# EAGLE design BMSMAX14921Based (EAGLE 8.3.1)
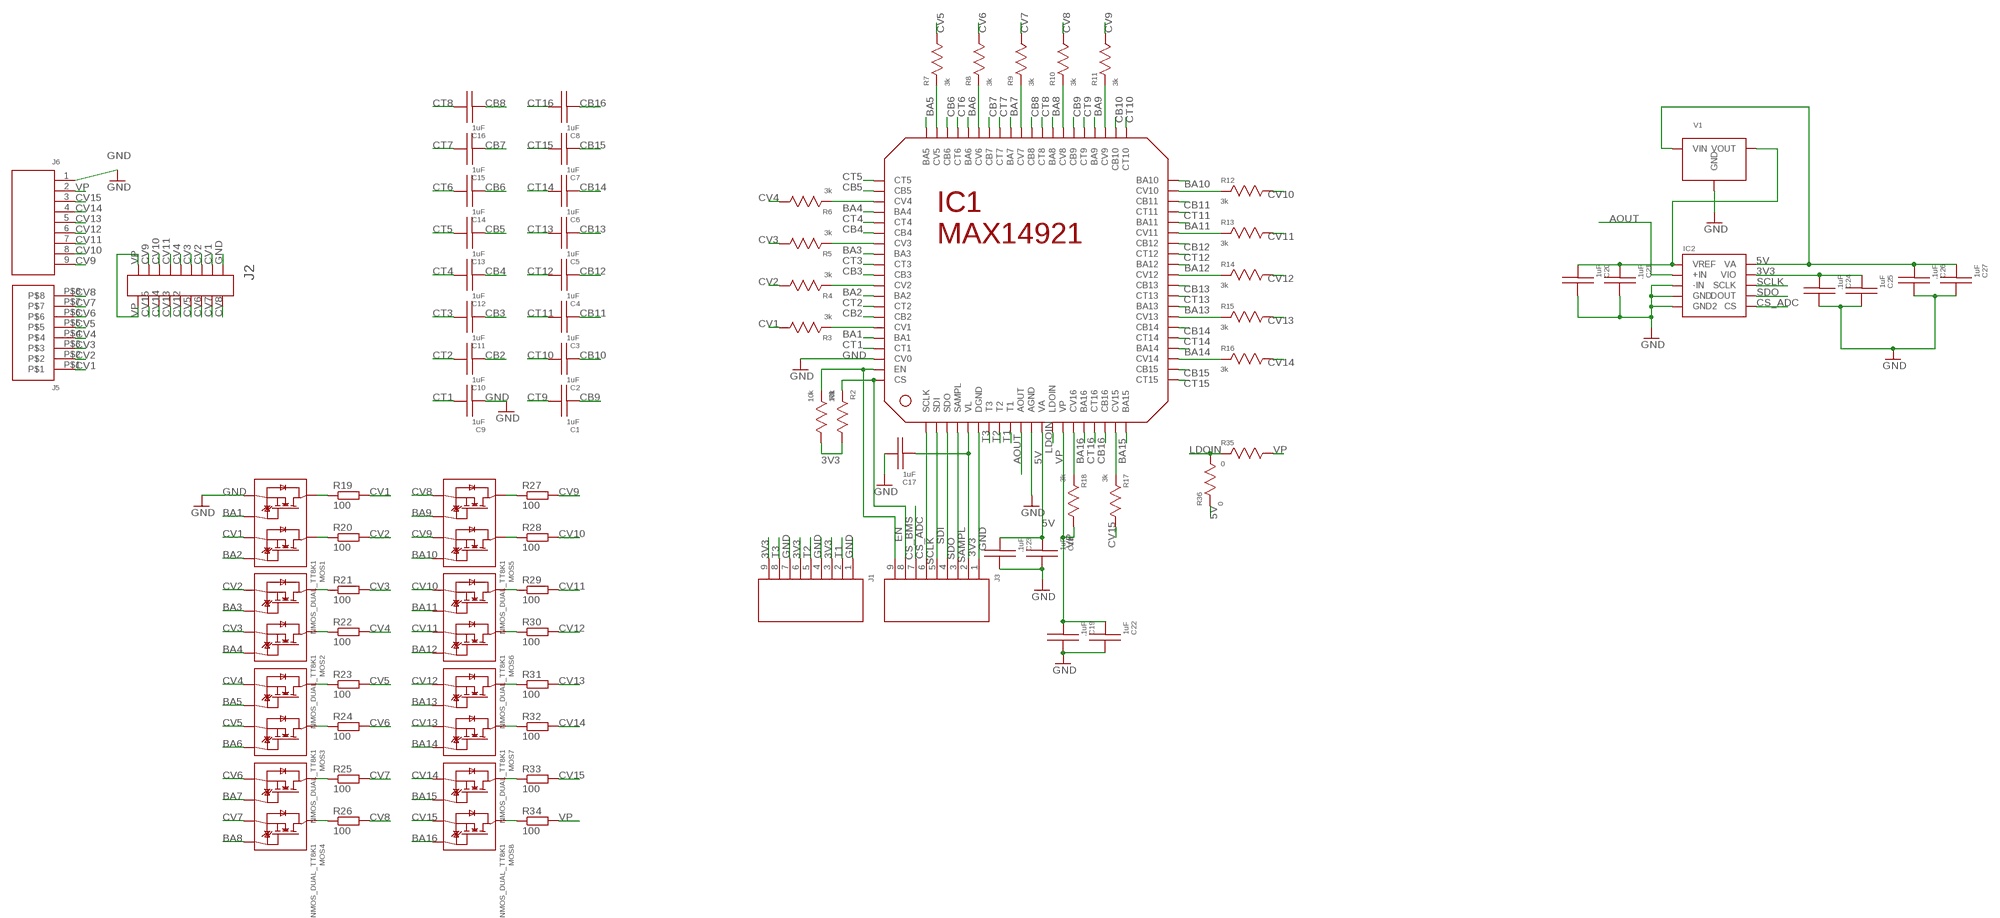
[diagram p0: schematic, sheet 1]

## Parts
C1  1uF  CHIP_CAP0805  [0805_(2012_METRIC)]
C2  1uF  CHIP_CAP0805  [0805_(2012_METRIC)]
C3  1uF  CHIP_CAP0805  [0805_(2012_METRIC)]
C4  1uF  CHIP_CAP0805  [0805_(2012_METRIC)]
C5  1uF  CHIP_CAP0805  [0805_(2012_METRIC)]
C6  1uF  CHIP_CAP0805  [0805_(2012_METRIC)]
C7  1uF  CHIP_CAP0805  [0805_(2012_METRIC)]
C8  1uF  CHIP_CAP0805  [0805_(2012_METRIC)]
C9  1uF  CHIP_CAP0805  [0805_(2012_METRIC)]
C10  1uF  CHIP_CAP0805  [0805_(2012_METRIC)]
C11  1uF  CHIP_CAP0805  [0805_(2012_METRIC)]
C12  1uF  CHIP_CAP0805  [0805_(2012_METRIC)]
C13  1uF  CHIP_CAP0805  [0805_(2012_METRIC)]
C14  1uF  CHIP_CAP0805  [0805_(2012_METRIC)]
C15  1uF  CHIP_CAP0805  [0805_(2012_METRIC)]
C16  1uF  CHIP_CAP0805  [0805_(2012_METRIC)]
C17  1uF  CHIP_CAP0805  [0805_(2012_METRIC)]
C18  1uF  CHIP_CAP0805  [0805_(2012_METRIC)]
C19  .1uF  CHIP_CAP0805  [0805_(2012_METRIC)]
C20  1uF  CHIP_CAP0805  [0805_(2012_METRIC)]
C21  .1uF  CHIP_CAP0805  [0805_(2012_METRIC)]
C22  1uF  CHIP_CAP0805  [0805_(2012_METRIC)]
C23  .1uF  CHIP_CAP0805  [0805_(2012_METRIC)]
C24  .1uF  CHIP_CAP0805  [0805_(2012_METRIC)]
C25  1uF  CHIP_CAP0805  [0805_(2012_METRIC)]
C26  .1uF  CHIP_CAP0805  [0805_(2012_METRIC)]
C27  1uF  CHIP_CAP0805  [0805_(2012_METRIC)]
IC1  MAX14921  [80TQFP]
IC2  ADC141S626  [10-VSSOP]
J1  CONNECTOR_9PIN  [9PIN_.1']
J2  CONNECTORJST2X9_2MM  [CONNECTOR9X2_2MMPITCH]
J3  CONNECTOR_9PIN  [9PIN_.1']
J5  CONNECTOR_8PIN  [8PIN_.1']
J6  CONNECTOR_9PIN  [9PIN_.1']
MOS1  NMOS_DUAL_TT8K1  [TSST8]
MOS2  NMOS_DUAL_TT8K1  [TSST8]
MOS3  NMOS_DUAL_TT8K1  [TSST8]
MOS4  NMOS_DUAL_TT8K1  [TSST8]
MOS5  NMOS_DUAL_TT8K1  [TSST8]
MOS6  NMOS_DUAL_TT8K1  [TSST8]
MOS7  NMOS_DUAL_TT8K1  [TSST8]
MOS8  NMOS_DUAL_TT8K1  [TSST8]
R1  10k  CHIP_RES0805  [0805_(2012_METRIC)]
R2  10k  CHIP_RES0805  [0805_(2012_METRIC)]
R3  3k  CHIP_RES0805  [0805_(2012_METRIC)]
R4  3k  CHIP_RES0805  [0805_(2012_METRIC)]
R5  3k  CHIP_RES0805  [0805_(2012_METRIC)]
R6  3k  CHIP_RES0805  [0805_(2012_METRIC)]
R7  3k  CHIP_RES0805  [0805_(2012_METRIC)]
R8  3k  CHIP_RES0805  [0805_(2012_METRIC)]
R9  3k  CHIP_RES0805  [0805_(2012_METRIC)]
R10  3k  CHIP_RES0805  [0805_(2012_METRIC)]
R11  3k  CHIP_RES0805  [0805_(2012_METRIC)]
R12  3k  CHIP_RES0805  [0805_(2012_METRIC)]
R13  3k  CHIP_RES0805  [0805_(2012_METRIC)]
R14  3k  CHIP_RES0805  [0805_(2012_METRIC)]
R15  3k  CHIP_RES0805  [0805_(2012_METRIC)]
R16  3k  CHIP_RES0805  [0805_(2012_METRIC)]
R17  3k  CHIP_RES0805  [0805_(2012_METRIC)]
R18  3k  CHIP_RES0805  [0805_(2012_METRIC)]
R19  100  R-EU_0411/3V  [0411V]
R20  100  R-EU_0411/3V  [0411V]
R21  100  R-EU_0411/3V  [0411V]
R22  100  R-EU_0411/3V  [0411V]
R23  100  R-EU_0411/3V  [0411V]
R24  100  R-EU_0411/3V  [0411V]
R25  100  R-EU_0411/3V  [0411V]
R26  100  R-EU_0411/3V  [0411V]
R27  100  R-EU_0411/3V  [0411V]
R28  100  R-EU_0411/3V  [0411V]
R29  100  R-EU_0411/3V  [0411V]
R30  100  R-EU_0411/3V  [0411V]
R31  100  R-EU_0411/3V  [0411V]
R32  100  R-EU_0411/3V  [0411V]
R33  100  R-EU_0411/3V  [0411V]
R34  100  R-EU_0411/3V  [0411V]
R35  0  CHIP_RES0805  [0805_(2012_METRIC)]
R36  0  CHIP_RES0805  [0805_(2012_METRIC)]
V1  REF3040  [SOT-23]

## Nets
3V3: C17.P$2 C24.P$2 C25.P$2 IC1.P$5(VL) IC2.P$9(VIO) J1.3 J1.6 J1.9 J3.2 R1.P$1 R2.P$1
5V: C18.P$2 C23.P$2 C26.P$2 C27.P$2 IC1.P$12(VA) IC2.P$10(VA) R36.P$2 V1.1(VIN)
AOUT: IC1.P$10(AOUT) IC2.P$2(+IN)
BA1: IC1.P$76(BA1) MOS1.P$2(G1)
BA2: IC1.P$72(BA2) MOS1.P$4(G2)
BA3: IC1.P$68(BA3) MOS2.P$2(G1)
BA4: IC1.P$64(BA4) MOS2.P$4(G2)
BA5: IC1.P$60(BA5) MOS3.P$2(G1)
BA6: IC1.P$56(BA6) MOS3.P$4(G2)
BA7: IC1.P$52(BA7) MOS4.P$2(G1)
BA8: IC1.P$48(BA8) MOS4.P$4(G2)
BA9: IC1.P$44(BA9) MOS5.P$2(G1)
BA10: IC1.P$40(BA10) MOS5.P$4(G2)
BA11: IC1.P$36(BA11) MOS6.P$2(G1)
BA12: IC1.P$32(BA12) MOS6.P$4(G2)
BA13: IC1.P$28(BA13) MOS7.P$2(G1)
BA14: IC1.P$24(BA14) MOS7.P$4(G2)
BA15: IC1.P$20(BA15) MOS8.P$2(G1)
BA16: IC1.P$16(BA16) MOS8.P$4(G2)
CB2: C10.P$2 IC1.P$74(CB2)
CB3: C11.P$2 IC1.P$70(CB3)
CB4: C12.P$2 IC1.P$66(CB4)
CB5: C13.P$2 IC1.P$62(CB5)
CB6: C14.P$2 IC1.P$58(CB6)
CB7: C15.P$2 IC1.P$54(CB7)
CB8: C16.P$2 IC1.P$50(CB8)
CB9: C1.P$2 IC1.P$46(CB9)
CB10: C2.P$2 IC1.P$42(CB10)
CB11: C3.P$2 IC1.P$38(CB11)
CB12: C4.P$2 IC1.P$34(CB12)
CB13: C5.P$2 IC1.P$30(CB13)
CB14: C6.P$2 IC1.P$26(CB14)
CB15: C7.P$2 IC1.P$22(CB15)
CB16: C8.P$2 IC1.P$18(CB16)
CS_ADC: IC2.P$6(CS) J3.7
CS_BMS: IC1.P$80(CS) J3.8 R2.P$2
CT1: C9.P$1 IC1.P$77(CT1)
CT2: C10.P$1 IC1.P$73(CT2)
CT3: C11.P$1 IC1.P$69(CT3)
CT4: C12.P$1 IC1.P$65(CT4)
CT5: C13.P$1 IC1.P$61(CT5)
CT6: C14.P$1 IC1.P$57(CT6)
CT7: C15.P$1 IC1.P$53(CT7)
CT8: C16.P$1 IC1.P$49(CT8)
CT9: C1.P$1 IC1.P$45(CT9)
CT10: C2.P$1 IC1.P$41(CT10)
CT11: C3.P$1 IC1.P$37(CT11)
CT12: C4.P$1 IC1.P$33(CT12)
CT13: C5.P$1 IC1.P$29(CT13)
CT14: C6.P$1 IC1.P$25(CT14)
CT15: C7.P$1 IC1.P$21(CT15)
CT16: C8.P$1 IC1.P$17(CT16)
CV1: J2.P$2 J5.P$1 MOS1.P$3(S2) R3.P$1 R19.2
CV2: J2.P$3 J5.P$2 MOS2.P$1(S1) R4.P$1 R20.2
CV3: J2.P$4 J5.P$3 MOS2.P$3(S2) R5.P$1 R21.2
CV4: J2.P$5 J5.P$4 MOS3.P$1(S1) R6.P$1 R22.2
CV5: J2.P$15 J5.P$5 MOS3.P$3(S2) R7.P$1 R23.2
CV6: J2.P$16 J5.P$6 MOS4.P$1(S1) R8.P$1 R24.2
CV7: J2.P$17 J5.P$7 MOS4.P$3(S2) R9.P$1 R25.2
CV8: J2.P$18 J5.P$8 MOS5.P$1(S1) R10.P$1 R26.2
CV9: J2.P$8 J6.9 MOS5.P$3(S2) R11.P$1 R27.2
CV10: J2.P$7 J6.8 MOS6.P$1(S1) R12.P$1 R28.2
CV11: J2.P$6 J6.7 MOS6.P$3(S2) R13.P$1 R29.2
CV12: J2.P$14 J6.6 MOS7.P$1(S1) R14.P$1 R30.2
CV13: J2.P$13 J6.5 MOS7.P$3(S2) R15.P$1 R31.2
CV14: J2.P$12 J6.4 MOS8.P$1(S1) R16.P$1 R32.2
CV15: J2.P$11 J6.3 MOS8.P$3(S2) R17.P$1 R33.2
EN: IC1.P$79(EN) J3.9 R1.P$2
GND: C9.P$2 C17.P$1 C18.P$1 C19.P$1 C20.P$1 C21.P$1 C22.P$1 C23.P$1 C24.P$1 C25.P$1 C26.P$1 C27.P$1 IC1.P$6(DGND) IC1.P$11(AGND) IC1.P$78(CV0) IC2.P$3(-IN) IC2.P$4(GND) IC2.P$5(GND2) J1.1 J1.4 J1.7 J2.P$1 J3.1 J6.1 MOS1.P$1(S1) V1.3(GND)
LDOIN: IC1.P$13(LDOIN) R35.P$2 R36.P$1
N$2: MOS1.P$7(D1) MOS1.P$8(D1) R19.1
N$8: C20.P$2 C21.P$2 IC2.P$1(VREF) V1.2(VOUT)
N$9: IC1.P$71(CV2) R4.P$2
N$11: IC1.P$67(CV3) R5.P$2
N$12: IC1.P$75(CV1) R3.P$2
N$26: IC1.P$63(CV4) R6.P$2
N$29: IC1.P$59(CV5) R7.P$2
N$30: IC1.P$55(CV6) R8.P$2
N$31: IC1.P$51(CV7) R9.P$2
N$32: IC1.P$47(CV8) R10.P$2
N$33: IC1.P$43(CV9) R11.P$2
N$34: IC1.P$39(CV10) R12.P$2
N$35: IC1.P$35(CV11) R13.P$2
N$36: IC1.P$31(CV12) R14.P$2
N$37: IC1.P$27(CV13) R15.P$2
N$38: IC1.P$23(CV14) R16.P$2
N$39: IC1.P$19(CV15) R17.P$2
N$40: IC1.P$15(CV16) R18.P$2
N$41: MOS1.P$5(D2) MOS1.P$6(D2) R20.1
N$42: MOS2.P$7(D1) MOS2.P$8(D1) R21.1
N$43: MOS2.P$5(D2) MOS2.P$6(D2) R22.1
N$44: MOS3.P$7(D1) MOS3.P$8(D1) R23.1
N$45: MOS3.P$5(D2) MOS3.P$6(D2) R24.1
N$46: MOS4.P$7(D1) MOS4.P$8(D1) R25.1
N$47: MOS4.P$5(D2) MOS4.P$6(D2) R26.1
N$48: MOS5.P$7(D1) MOS5.P$8(D1) R27.1
N$49: MOS5.P$5(D2) MOS5.P$6(D2) R28.1
N$50: MOS6.P$7(D1) MOS6.P$8(D1) R29.1
N$51: MOS6.P$5(D2) MOS6.P$6(D2) R30.1
N$52: MOS7.P$7(D1) MOS7.P$8(D1) R31.1
N$53: MOS7.P$5(D2) MOS7.P$6(D2) R32.1
N$54: MOS8.P$7(D1) MOS8.P$8(D1) R33.1
N$55: MOS8.P$5(D2) MOS8.P$6(D2) R34.1
SAMPL: IC1.P$4(SAMPL) J3.3
SCLK: IC1.P$1(SCLK) IC2.P$8(SCLK) J3.6
SDI: IC1.P$2(SDI) J3.5
SDO: IC1.P$3(SDO) IC2.P$7(DOUT) J3.4
T1: IC1.P$9(T1) J1.2
T2: IC1.P$8(T2) J1.5
T3: IC1.P$7(T3) J1.8
VP: C19.P$2 C22.P$2 IC1.P$14(VP) J2.P$9 J2.P$10 J6.2 R18.P$1 R34.2 R35.P$1

## Library data of the parts
C1-C27 = lolomolo:CHIP_CAP
IC1 = MarkIIEaglelbr:MAX14921
IC2 = MarkIIEaglelbr:ADC141S626
J1 J3 J6 = lolomolo:CONNECTOR_9PIN
J2 = MarkIIEaglelbr:CONNECTORJST2X9_2MM
J5 = lolomolo:CONNECTOR_8PIN
MOS1-MOS8 = MarkIIEaglelbr:NMOS_DUAL_TT8K1
R1-R18 R35 R36 = lolomolo:CHIP_RES
R19-R34 = rcl:R-EU_: RESISTOR, European symbol
V1 = MarkIIEaglelbr:REF3040

## Board
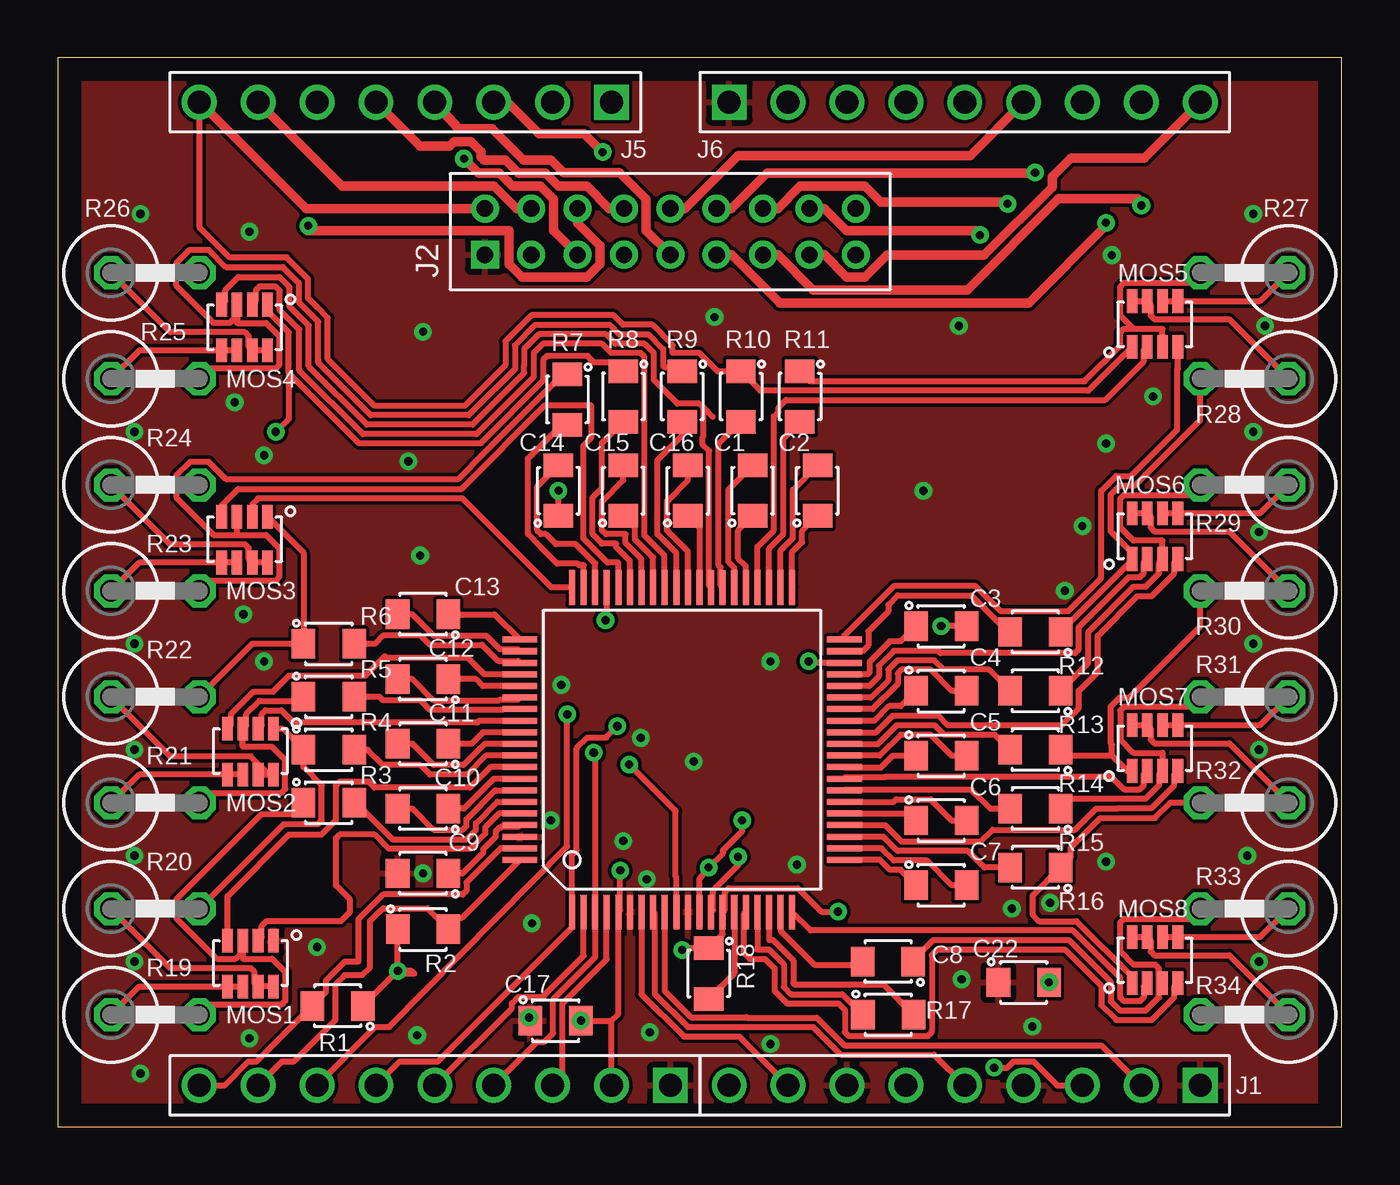
[diagram p1: board, top side]
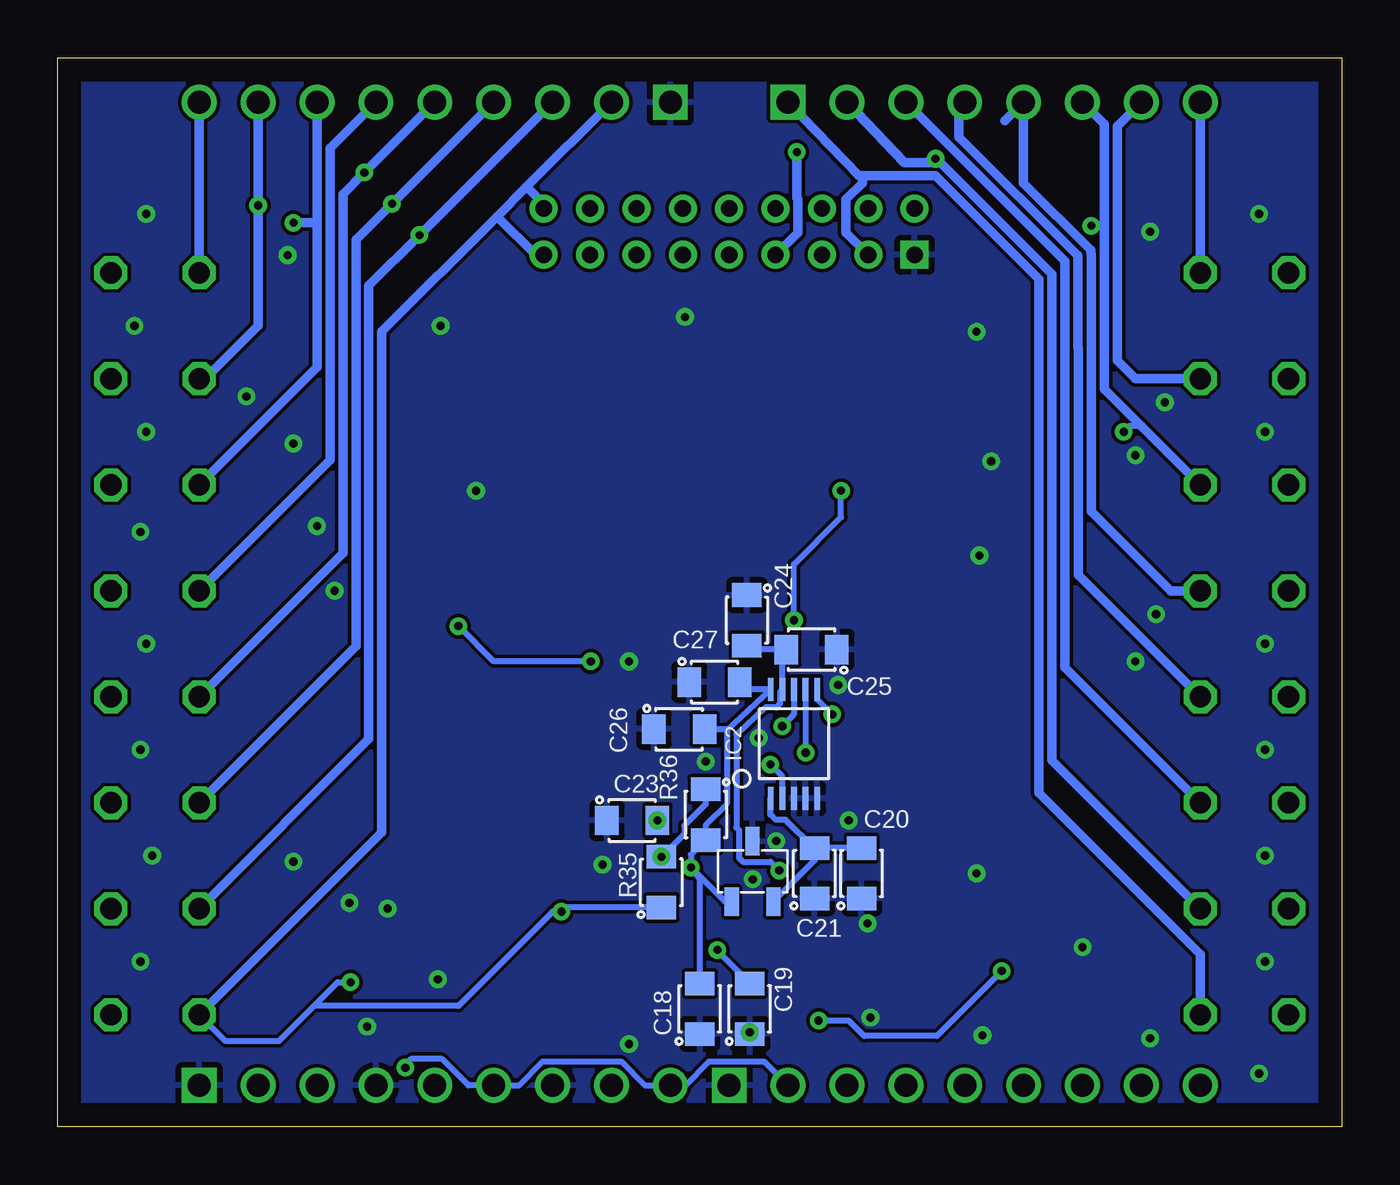
[diagram p2: board, bottom side, seen from below]

Size 55.37 x 46.1 mm. Coordinates in mm from the lower left corner, seen from the top.
Outline: 0,0 55.37,0 55.37,46.1 0,46.1 0,0
Copper layers (1*16): Top 0.035mm / dielectric 1.5mm / Bottom 0.035mm
Design rules "default": minimum track width 6mil, minimum drill 0.35mm, track to track 6mil, track to pad 6mil, pad to pad 6mil, via to via 6mil, smd to smd 6mil, copper to edge 40mil, drill to drill 6mil, minimum pad ring 10mil, minimum via ring 8mil, stop-mask expansion 4mil, vias tented up to drill 0mil, thermal gap 10mil

### Footprints (pad centres in the part's own frame; a part is rotated, then mirrored left to right if it is on the bottom)
0805_(2012_METRIC) = smd 1.016 x 1.27: P$1 -1.087,0; P$2 1.097,0
80TQFP = smd 0.26 x 1.5: P$1 -4.75,-7; P$2 -4.25,-7; P$3 -3.75,-7; P$4 -3.25,-7; P$5 -2.75,-7; P$6 -2.25,-7; P$7 -1.75,-7; P$8 -1.25,-7; P$9 -0.75,-7; P$10 -0.25,-7; P$11 0.25,-7; P$12 0.75,-7; P$13 1.25,-7; P$14 1.75,-7; P$15 2.25,-7; P$16 2.75,-7; P$17 3.25,-7; P$18 3.75,-7; P$19 4.25,-7; P$20 4.75,-7; P$41 4.75,7; P$42 4.25,7; P$43 3.75,7; P$44 3.25,7; P$45 2.75,7; P$46 2.25,7; P$47 1.75,7; P$48 1.25,7; P$49 0.75,7; P$50 0.25,7; P$51 -0.25,7; P$52 -0.75,7; P$53 -1.25,7; P$54 -1.75,7; P$55 -2.25,7; P$56 -2.75,7; P$57 -3.25,7; P$58 -3.75,7; P$59 -4.25,7; P$60 -4.75,7 | smd 1.5 x 0.26: P$21 7,-4.75; P$22 7,-4.25; P$23 7,-3.75; P$24 7,-3.25; P$25 7,-2.75; P$26 7,-2.25; P$27 7,-1.75; P$28 7,-1.25; P$29 7,-0.75; P$30 7,-0.25; P$31 7,0.25; P$32 7,0.75; P$33 7,1.25; P$34 7,1.75; P$35 7,2.25; P$36 7,2.75; P$37 7,3.25; P$38 7,3.75; P$39 7,4.25; P$40 7,4.75; P$61 -7,4.75; P$62 -7,4.25; P$63 -7,3.75; P$64 -7,3.25; P$65 -7,2.75; P$66 -7,2.25; P$67 -7,1.75; P$68 -7,1.25; P$69 -7,0.75; P$70 -7,0.25; P$71 -7,-0.25; P$72 -7,-0.75; P$73 -7,-1.25; P$74 -7,-1.75; P$75 -7,-2.25; P$76 -7,-2.75; P$77 -7,-3.25; P$78 -7,-3.75; P$79 -7,-4.25; P$80 -7,-4.75
10-VSSOP = smd 0.25 x 1: P$1 -1,-2.35; P$2 -0.5,-2.35; P$3 0,-2.35; P$4 0.5,-2.35; P$5 1,-2.35; P$6 1,2.35; P$7 0.5,2.35; P$8 0,2.35; P$9 -0.5,2.35; P$10 -1,2.35
9PIN_.1' = drill 0.991 square: 1 -10.16,0 | drill 0.991: 2 -7.62,0; 3 -5.08,0; 4 -2.54,0; 5 0,0; 6 2.54,0; 7 5.08,0; 8 7.62,0; 9 10.16,0
CONNECTOR9X2_2MMPITCH = drill 0.7 square: P$1 -8,-1 | drill 0.7: P$2 -6,-1; P$3 -4,-1; P$4 -2,-1; P$5 0,-1; P$6 2,-1; P$7 4,-1; P$8 6,-1; P$9 8,-1; P$10 8,1; P$11 6,1; P$12 4,1; P$13 2,1; P$14 0,1; P$15 -2,1; P$16 -4,1; P$17 -6,1; P$18 -8,1
8PIN_.1' = drill 0.991 square: P$1 -8.89,0 | drill 0.991: P$2 -6.35,0; P$3 -3.81,0; P$4 -1.27,0; P$5 1.27,0; P$6 3.81,0; P$7 6.35,0; P$8 8.89,0
TSST8 = smd 0.457 x 1.016: P$1 -0.66,-0.914; P$2 0,-0.914; P$3 0.66,-0.914; P$4 1.321,-0.914; P$5 -0.66,1.067; P$6 0,1.067; P$7 0.66,1.067; P$8 1.321,1.067
0411V = drill 0.914 octagon: 1 -2.54,0; 2 1.27,0
SOT-23 = smd 1.219 x 0.61: 1 -2.61,0.905; 2 -2.61,-0.895; 3 -0.01,0.005

### Placement (x,y rotation side)
C1  29.97,27.43 90 top
C2  32.77,27.43 90 top
C3  38.1,21.59 0 top
C4  38.1,18.8 0 top
C5  38.1,16 0 top
C6  38.1,13.21 0 top
C7  38.1,10.41 0 top
C8  35.81,4.83 0 top
C9  15.75,10.92 180 top
C10  15.75,13.72 180 top
C11  15.75,16.51 180 top
C12  15.75,19.3 180 top
C13  15.75,22.1 180 top
C14  21.59,27.43 90 top
C15  24.38,27.43 90 top
C16  27.18,27.43 90 top
C17  21.46,4.57 0 top
C18  27.69,5.08 90 bottom
C19  25.53,5.08 90 bottom
C20  20.7,10.92 90 bottom
C21  22.73,10.92 90 bottom
C22  41.66,6.22 0 top
C23  30.61,13.21 0 bottom
C24  25.65,21.84 270 bottom
C25  22.86,20.57 180 bottom
C26  28.57,17.14 0 bottom
C27  27.05,19.18 0 bottom
IC1  26.92,16.26 0 top
IC2  23.62,16.51 0 bottom
J1  39.12,1.78 180 top
J2  26.42,38.61 0 top
J3  16.26,1.78 180 top
J5  14.99,44.2 180 top
J6  39.12,44.2 0 top
MOS1  8.64,7.11 180 top
MOS2  8.64,16.26 180 top
MOS3  8.38,25.4 180 top
MOS4  8.38,34.54 180 top
MOS5  46.99,34.54 0 top
MOS6  46.99,25.4 0 top
MOS7  46.99,16.26 0 top
MOS8  46.99,7.11 0 top
R1  12.06,5.21 180 top
R2  15.75,8.51 0 top
R3  11.68,13.97 0 top
R4  11.68,16.26 0 top
R5  11.68,18.54 0 top
R6  11.68,20.83 0 top
R7  21.97,31.37 270 top
R8  24.38,31.5 270 top
R9  26.92,31.5 270 top
R10  29.46,31.5 270 top
R11  32,31.5 270 top
R12  42.16,21.34 180 top
R13  42.16,18.8 180 top
R14  42.16,16.26 180 top
R15  42.16,13.72 180 top
R16  42.16,11.18 180 top
R17  35.81,7.11 180 top
R18  28.07,6.6 270 top
R19  4.83,4.83 0 top
R20  4.83,9.4 0 top
R21  4.83,13.97 0 top
R22  4.83,18.54 0 top
R23  4.83,23.11 0 top
R24  4.83,27.69 0 top
R25  4.83,32.26 0 top
R26  4.83,36.83 0 top
R27  50.55,36.83 180 top
R28  50.55,32.26 180 top
R29  50.55,27.69 180 top
R30  50.55,23.11 180 top
R31  50.55,18.54 180 top
R32  50.55,13.97 180 top
R33  50.55,9.4 180 top
R34  50.55,4.83 180 top
R35  29.34,10.54 90 bottom
R36  27.43,13.46 270 bottom
V1  25.4,12.32 90 bottom

### Tracks (layer width: path | path; a pad name or v marks a point on that pad's centre or on a via)
3V3  (via drill 0.35)
  Top 0.254: J3.2 23.88,4.55 | v14.66,6.72 R2.P$1 | v14.66,6.72 R1.P$1 | v24.26,11.05 24.26,9.34 IC1.P$5 24.17,4.85 23.88,4.55 | C17.P$2 23.86,4.57 23.88,4.55 | v40.39,2.54 40.96,2.54 41.23,2.81 42.08,2.81 43.11,1.78 J1.3 | v14.66,6.72 14.77,6.6 15.37,6.6 15.26,6.72 v14.66,6.72
  Bottom 0.254: J3.2 24.91,2.81 27.28,2.81 28.31,1.78 J1.9 30.04,1.78 31.07,2.81 34.46,2.81 35.49,1.78 J1.6 37.66,1.78 38.8,2.92 40.13,2.92 40.39,2.67 v40.39,2.54 | v14.66,6.72 17.46,3.91 20.59,3.91 21.25,4.57 C17.P$2 22.61,4.57 | 24.15,20.57 C25.P$2 | 24.15,20.57 25.48,20.57 C24.P$2 | 24.25,20.47 24.15,20.57 | 24.15,20.57 24.12,20.55 IC2.P$9 24.22,18.77 24.22,18.25 24.38,18.08 24.86,18.08 26.11,16.92 26.11,12.91 26.11,12.9 25.99,12.78 25.99,11.58 25.83,11.42 24.63,11.42 v24.26,11.05
  other vias: 22.56,4.57
5V  (via drill 0.35)
  Top 0.254: IC1.P$12 27.67,10.68 v28.07,11.18 28.68,11.79 28.68,11.91 29.51,12.74 C23.P$2
  Bottom 0.254: C18.P$2 27.69,10.67 v28.07,11.18 | 26.52,17.09 IC2.P$10 25.64,18.86 C27.P$2 | 26.52,17.09 26.52,13.93 27.43,13.01 R36.P$2 28.07,11.73 v28.07,11.18 | C26.P$2 26.57,17.14 26.52,17.09 | V1.1 26.6,9.71 v28.07,11.18 | C23.P$2 29.51,13.16 29.46,13.34 29.46,13.25 C23.P$2
  other vias: 29.51,13.21
AOUT  (via drill 0.35)
  Top 0.254: IC1.P$10 26.67,10.75 26.65,10.78 26.65,13.61 v24.64,15.62
  Bottom 0.254: IC2.P$2 24.12,15.11 v24.64,15.62
BA1
  Top 0.254: MOS1.P$2 8.79,8.18 8.79,8.65 9.01,8.87 12.21,8.87 12.6,9.25 12.6,9.8 11.99,10.4 11.99,12.44 12.16,12.6 13.66,12.6 14.27,11.99 17.8,11.99 18.43,12.63 18.43,12.91 19.03,13.51 IC1.P$76
BA2
  Top 0.254: MOS1.P$4 7.32,9.94 9.97,12.6 11.37,12.6 11.99,13.22 11.99,14.72 12.16,14.88 13.4,14.88 13.66,14.63 17.78,14.63 18.65,15.51 IC1.P$72
BA3
  Top 0.254: MOS2.P$2 8.79,17.32 8.79,17.79 8.95,17.96 9.64,17.96 10.17,17.42 18.1,17.42 18.18,17.51 IC1.P$68
BA4
  Top 0.254: MOS2.P$4 7.47,17.32 7.47,17.79 8.44,18.77 9.29,18.77 9.97,19.46 13.27,19.46 13.7,19.89 | 13.7,19.89 14.09,20.29 | IC1.P$64 18.4,19.51 17.69,20.22 14.03,20.22 13.7,19.89
BA5
  Top 0.254: MOS3.P$2 8.38,26.85 8.64,27.1 17.45,27.1 21.3,23.26 IC1.P$60
BA6
  Top 0.254: MOS3.P$4 7.06,26.79 7.78,27.51 17.41,27.51 21.02,31.11 22.99,31.11 22.99,29.7 22.66,29.37 22.66,25.39 23.71,24.33 24.17,24.33 IC1.P$56
BA7
  Top 0.254: MOS4.P$2 8.53,35.61 8.53,36.08 8.7,36.25 9.39,36.25 9.57,36.06 9.57,35.23 10.41,34.39 10.41,32.62 13.16,29.87 18.05,29.87 20.52,32.34 20.52,33.38 20.93,33.78 23.47,33.78 23.88,33.37 25.14,33.37 25.3,33.21 25.3,25.5 26.16,24.64 IC1.P$52
BA8
  Top 0.254: MOS4.P$4 7.21,35.61 7.21,36.08 7.78,36.65 9.55,36.65 9.98,36.23 9.98,35.4 10.82,34.55 10.82,32.79 13.33,30.28 17.89,30.28 20.12,32.51 20.12,32.85 | 28.25,30.62 27.84,31.02 | IC1.P$48 28.09,23.34 28.09,29.15 27.81,29.43 27.81,29.75 27.84,29.77 27.84,31.02 | 27.84,31.02 27.68,31.19 26.73,31.19 25.7,32.21 25.7,33.38 25.3,33.78 24.04,33.78 23.64,34.18 20.76,34.18 20.12,33.54 20.12,32.85 | 20.12,32.85
BA9
  Top 0.254: MOS5.P$2 46.84,33.48 46.84,33.01 45.17,31.34 31.41,31.34 31.09,31.02 31.09,30.84 30.89,30.63 30.89,25.72 30.17,25.01 IC1.P$44
BA10
  Top 0.254: MOS5.P$4 48.31,32.69 48.28,32.67 48.28,30.06 46.29,28.07 45.65,28.07 45.01,27.43 45.01,23.67 43.59,22.25 40.65,22.25 39.58,23.32 36.05,23.32 33.92,21.19 IC1.P$40
BA11
  Top 0.254: MOS6.P$2 46.84,24.33 46.84,23.86 46.67,23.7 46.19,23.7 44.04,21.55 44.04,20.59 43.88,20.42 38.08,20.42 37.97,20.52 36.05,20.52 35.41,19.88 35.41,19.42 35,19.01 IC1.P$36
BA12
  Top 0.254: MOS6.P$4 48.16,24.33 48.16,23.86 47.18,22.89 46.57,22.89 44.85,21.17 44.85,19.61 44.04,18.8 44.04,18.05 43.32,17.32 38.38,17.32 37.97,17.73 36.02,17.73 35.3,17.01 IC1.P$32
BA13
  Top 0.254: MOS7.P$2 46.84,15.19 46.84,14.72 46.67,14.55 45.98,14.55 45.45,15.09 35.67,15.09 35.66,15.07 33.99,15.07 IC1.P$28
BA14
  Top 0.254: MOS7.P$4 48.16,15.19 48.16,14.72 47.18,13.74 45.74,13.74 45.72,13.72 44.79,13.72 43.88,12.8 40.33,12.8 39.82,12.29 36.39,12.29 35.68,13.01 IC1.P$24
BA15
  Top 0.254: MOS8.P$2 46.84,6.04 46.84,5.57 46.67,5.41 45.98,5.41 45.82,5.57 45.82,6.41 43.77,8.46 32.47,8.46 IC1.P$20
BA16
  Top 0.254: MOS8.P$4 48.16,6.04 48.16,5.57 47.18,4.6 45.65,4.6 45.01,5.24 45.01,6.07 43.43,7.64 37.94,7.64 37.69,7.4 37.72,7.37 37.72,4.19 37.7,4.17 37.7,4.08 37.53,3.91 34.1,3.91 33.94,4.08 33.94,5.04 33.67,5.31 31.45,5.31 30.91,5.85 30.91,6.83 30.51,7.23 29.85,7.23 29.58,7.5 29.58,8.39 | IC1.P$16 29.58,9.16 29.58,8.39 | 29.58,8.39 29.58,8.33
CB2
  Top 0.254: C10.P$2 15.3,13.72 16.21,12.8 17.46,12.8 17.62,12.96 17.62,13.25 18.89,14.52 18.89,14.51 IC1.P$74
CB3
  Top 0.254: C11.P$2 15.3,16.51 16.21,15.6 17.49,15.6 18.4,16.51 IC1.P$70
CB4
  Top 0.254: C12.P$2 15.3,19.3 16.21,18.39 19.03,18.39 19.06,18.41 19.83,18.41 IC1.P$66
CB5
  Top 0.254: C13.P$2 15.3,22.1 16.21,21.18 18.47,21.18 19.06,20.6 19.83,20.6 IC1.P$62
CB6
  Top 0.254: IC1.P$58 23.17,24.29 22.34,25.13 21.48,25.13 21.05,25.56 20.84,25.56 20.68,25.72 20.68,27.61 C14.P$2
CB7
  Top 0.254: IC1.P$54 25.17,24.48 24.49,25.16 24.49,25.56 23.63,25.56 23.47,25.72 23.47,26.97 24.38,27.88 C15.P$2
CB8
  Top 0.254: C16.P$2 27.18,27.88 26.26,26.97 26.26,25.72 27.17,24.81 IC1.P$50
CB9
  Top 0.254: IC1.P$46 29.17,24.11 28.93,24.35 28.93,27.48 C1.P$2
CB10
  Top 0.254: IC1.P$42 31.17,24.86 31.7,25.39 31.7,27.46 C2.P$2
CB11  (via drill 0.35)
  Top 0.254: C3.P$2 v38.1,21.59 | IC1.P$38 32.45,20.01 v32.38,20.07
  Bottom 0.254: v32.38,20.07 36.58,20.07 v38.1,21.59
CB12
  Top 0.254: C4.P$2 38.55,18.8 37.64,19.71 36.39,19.71 36.23,19.55 36.23,19.09 35.15,18.01 IC1.P$34
CB13
  Top 0.254: C5.P$2 38.55,16 37.64,16.92 36.35,16.92 35.44,16 IC1.P$30
CB14
  Top 0.254: C6.P$2 38.55,13.21 37.64,14.12 36.16,14.12 36.04,14.01 IC1.P$26
CB15
  Top 0.254: C7.P$2 38.55,10.41 37.48,11.48 36.05,11.48 35.53,12.01 IC1.P$22
CB16
  Top 0.254: IC1.P$18 30.67,8.05 30.85,8.05 31.73,7.17 31.73,6.19 31.78,6.13 35.61,6.13 C8.P$2
CS_ADC  (via drill 0.35)
  Top 0.254: J3.7 13.69,4.29 14.29,4.29 21.97,12.1 v21.97,17.78
  Bottom 0.254: IC2.P$6 22.62,18.43 v21.97,17.78
CS_BMS
  Top 0.254: IC1.P$80 17.43,9.01 17.22,9.01 R2.P$2 15.93,9.42 14.04,9.42 13.89,9.28 13.87,9.28 13.46,8.87 13.46,6.86 13.13,6.53 12.36,6.53 11.96,6.13 11.96,4.59 10.16,2.79 9.65,2.79 J3.8
CT1
  Top 0.254: C9.P$1 17.45,10.92 18.36,11.84 18.36,11.98 18.89,12.51 18.89,12.75 19.06,12.91 19.14,12.91 19.18,12.95 19.87,12.95 IC1.P$77
CT2
  Top 0.254: C10.P$1 17.51,13.72 18.8,15.01 IC1.P$73
CT3
  Top 0.254: C11.P$1 17.83,16.51 18.33,17.01 IC1.P$69
CT4
  Top 0.254: C12.P$1 18.03,19.3 18.32,19.01 IC1.P$65
CT5
  Top 0.254: IC1.P$61 18.83,22.1 C13.P$1
CT6  (via drill 0.35)
  Top 0.254: C14.P$1 v21.59,27.43 | IC1.P$57 23.67,21.9 v23.62,21.84
  Bottom 0.254: v23.62,21.84 23.62,24.26 21.59,26.29 v21.59,27.43
CT7
  Top 0.254: IC1.P$53 25.67,24.55 24.89,25.33 24.89,25.84 C15.P$1
CT8
  Top 0.254: C16.P$1 27.67,25.85 IC1.P$49
CT9
  Top 0.254: IC1.P$45 29.67,24.18 29.34,24.51 29.34,25.71 C1.P$1
CT10
  Top 0.254: IC1.P$41 31.67,24.79 32.11,25.22 32.11,25.68 C2.P$1
CT11
  Top 0.254: C3.P$1 36.35,20.93 35.88,20.93 35.01,20.05 35.01,19.59 34.92,19.51 IC1.P$37
CT12
  Top 0.254: C4.P$1 36.35,18.14 35.85,18.14 35.22,17.51 IC1.P$33
CT13
  Top 0.254: C5.P$1 36.02,16 35.49,15.48 33.95,15.48 IC1.P$29
CT14
  Top 0.254: IC1.P$25 36.72,13.51 C6.P$1
CT15
  Top 0.254: C7.P$1 36.35,11.07 35.88,11.07 35.45,11.51 IC1.P$21
CT16
  Top 0.254: IC1.P$17 30.17,7.64 30.68,7.64 31.32,7 31.32,6.02 31.62,5.71 33.84,5.71 C8.P$1
CV1
  Top 0.254: R19.2 6.53,5.26 9.64,5.26 9.8,5.42 9.8,6.67 9.23,7.24 7.98,7.24 MOS1.P$3 7.98,7.55 7.66,7.24 6.85,7.24 5.11,8.99 5.11,9.81 8.76,13.46 10.09,13.46 R3.P$1
  Bottom 0.406: 20.68,41.02 17.53,41.02 13.06,36.55 13.06,14.4 6.1,7.44 R19.2 | 20.68,41.02 20.83,41.02 J5.P$1 | 20.68,41.02 20.68,40.7 21.38,40.01 21.38,38.57 J2.P$2
CV2  (via drill 0.35)
  Top 0.254: MOS2.P$1 9.68,17.17 R4.P$1 10.6,15.51 11.38,14.72 11.38,13.22 11.22,13.06 9.75,13.06 R20.2
  Top 0.406: J2.P$3 21.38,38.65 21.38,40.01 20.81,40.57 19.6,40.57 19.42,40.75 19.42,40.78 19.39,40.78 19.05,41.13 18.14,41.13 v17.51,41.76
  Bottom 0.406: R20.2 12.5,15.8 12.5,36.78 17.3,41.58 | J5.P$2 18.85,41.58 17.3,41.58 | v17.51,41.76 17.47,41.76 17.3,41.58
CV3  (via drill 0.35)
  Top 0.254: R5.P$1 10.42,18.36 8.7,18.36 8.13,17.79 8.13,17.32 MOS2.P$3 7.98,16.38 9.23,16.38 9.8,15.81 9.8,14.56 9.64,14.4 6.53,14.4 R21.2
  Top 0.406: v23.5,42.04 22.7,42.84 20.75,42.84 19.39,44.2 J5.P$3
  Bottom 0.406: R21.2 11.94,19.81 11.94,37.34 J5.P$3 | v23.5,42.04 23.5,40.04 23.46,40.01 23.46,38.57 J2.P$4
CV4
  Top 0.254: MOS3.P$1 10.6,24.76 R6.P$1 8.38,20.83 R22.2
  Top 0.406: J2.P$5 25.38,38.65 25.38,40.01 24.23,41.15 21.81,41.15 21.28,41.69 20.09,41.69 18.73,43.05 17.28,43.05 J5.P$4
  Bottom 0.406: R22.2 11.35,23.8 11.35,33.58 11.38,33.6 11.38,37.57 16.5,42.69 16.5,43.96 J5.P$4
CV5
  Top 0.254: 7.72,25.53 MOS3.P$3 | R23.2 6.53,23.55 9.39,23.55 9.55,23.71 9.55,24.96 8.98,25.53 7.72,25.53 | R7.P$1 21.84,32.51 21.88,32.51 21.9,32.49 21.82,32.49 18.39,29.06 | 7.72,25.53 6.72,25.53 5.11,27.14 5.11,28.1 5.69,28.68 6.51,28.68 7.24,27.94 17.27,27.94 18.39,29.06 | 18.39,29.06
  Top 0.406: J2.P$15 23.77,39.61 22.81,40.57 21.6,40.57 21.05,41.13 19.86,41.13 19.3,41.69 18.37,41.69 18.25,41.81 18.25,42.06 17.82,42.49 17.08,42.49 16.89,42.29 15.62,42.29 J5.P$5
  Bottom 0.406: R23.2 7.37,23.11 10.79,26.54 10.79,37.65 10.82,37.67 10.82,37.8 13.72,40.7 J5.P$5 14.51,43.4
CV6  (via drill 0.35)
  Top 0.254: MOS4.P$1 9.04,35.18 9.96,34.27 9.96,32.96 9.96,32.5 | 9.96,32.5 9.96,30.53 v9.4,29.97 | R8.P$1 24,32.96 23.13,32.96 22.85,33.24 21.09,33.24 20.93,33.08 20.93,32.17 18.22,29.47 12.99,29.47 9.96,32.5
  Top 0.406: J2.P$16 22.42,38.97 23.38,38.01 23.38,37.21 22.81,36.65 20.02,36.65 19.46,37.21 19.46,38.65 10.76,38.65 10.67,38.73 v10.79,38.86
  Bottom 0.254: 8.64,30.23 9.14,30.23 v9.4,29.97
  Bottom 0.406: R24.2 8.64,30.23 10.23,31.82 10.23,38.77 | 10.23,38.77 10.23,43.25 J5.P$6 | v10.79,38.86 10.33,38.86 10.23,38.77
CV7
  Top 0.254: MOS4.P$3 7.72,34.8 | 7.72,34.8 7.72,34.67 8.98,34.67 9.55,34.1 9.55,32.85 9.39,32.69 6.53,32.69 R25.2 | 7.72,34.8 7.53,34.8 7.41,34.67 6.72,34.67 5.11,36.28 5.11,37.24 5.69,37.82 6.51,37.82 7.24,37.08 9.7,37.08 10.39,36.4 10.39,35.56 10.99,34.96 | 10.99,34.96 | 10.99,34.96 11.23,34.72 11.23,33.07 11.23,33.06 11.23,32.95 13.5,30.68 17.72,30.68 17.96,30.92 | R9.P$1 26.74,32.77 26.16,32.77 26.11,32.82 26.11,33.54 25.47,34.18 24.21,34.18 23.81,34.59 20.59,34.59 19.71,33.71 19.71,32.68 17.96,30.92 | 17.96,30.92
  Top 0.406: J2.P$17 19.77,39.61 18.81,40.57 12.26,40.57 J5.P$7
  Bottom 0.406: R25.2 8.89,32.26 9.68,33.04 9.68,43.16 J5.P$7
CV8
  Top 0.254: 11.16,35.37 | 11.16,35.37 10.79,35.73 10.79,36.56 9.87,37.49 7.41,37.49 6.1,38.81 6.1,44.22 J5.P$8 | 11.16,35.37 11.64,34.88 11.64,33.12 13.67,31.09 17.55,31.09 19.3,32.85 19.3,33.88 20.42,35 23.98,35 24.38,34.59 25.64,34.59 26.52,33.71 26.52,33.37 27.68,33.37 28.46,32.58 R10.P$1 30.3,31.75 44.45,31.75 MOS5.P$1
  Top 0.406: 17.85,39.61 J2.P$18 10.71,39.61 6.1,44.22
  Bottom 0.406: J5.P$8 R26.2
CV9
  Top 0.254: MOS5.P$3 47.65,34.42 46.39,34.42 | R27.2 48.84,36.4 45.98,36.4 45.82,36.23 45.82,34.99 46.39,34.42 | R11.P$1 32.43,32.16 44.28,32.16 45.82,33.7 45.82,34.25 45.98,34.42 46.39,34.42
  Top 0.406: J2.P$8 33.06,37.61 34.02,36.65 34.81,36.65 35.76,37.59 39.95,37.59 42.89,40.53 42.89,40.98 43.69,41.78 46.86,41.78 J6.9
  Bottom 0.406: J6.9 R27.2
CV10  (via drill 0.35)
  Top 0.254: R12.P$1 46.33,24.41 MOS6.P$1 46.33,24.76 45.41,25.68 45.41,27.26 45.82,27.66 46.46,27.66 49.28,30.48 R28.2
  Top 0.406: J2.P$7 31.06,37.61 32.58,36.09 39.23,36.09 43.16,40.02 46.59,40.02 46.74,39.88 v46.74,39.74
  Bottom 0.406: R28.2 49.02,32.26 46.74,34.54 v46.74,39.74 J6.8
CV11  (via drill 0.35)
  Top 0.254: R13.P$1 44.45,19.99 44.45,21.34 46.4,23.29 46.93,23.29 47.5,23.86 47.5,24.33 MOS6.P$3 47.65,25.27 46.39,25.27 45.82,25.84 45.82,27.09 45.98,27.25 48.84,27.25 R29.2
  Top 0.406: J2.P$6 29.06,37.61 31.14,35.53 41.88,35.53 45.21,38.86 v45.21,38.99
  Bottom 0.406: R29.2 44.2,32.77 44.2,38.99 | 44.2,38.99 J6.7 | v45.21,38.99 44.2,38.99
CV12
  Top 0.254: R14.P$1 43.51,16 45.47,16 | 45.47,16 46.13,15.34 MOS7.P$1 | 45.47,16 45.47,16.48 45.41,16.53 45.41,18.11 45.82,18.52 46.23,18.52 49.28,21.57 R30.2
  Top 0.406: J2.P$14 27.06,39.61 29.34,41.89 39.35,41.89 J6.6
  Bottom 0.406: R30.2 43.64,28.75 43.64,42.22 J6.6
CV13  (via drill 0.35)
  Top 0.254: R15.P$1 43.68,14.15 46.93,14.15 47.5,14.72 47.5,15.19 MOS7.P$3 47.65,16.13 46.39,16.13 45.82,16.7 45.82,17.95 45.98,18.11 48.84,18.11 R31.2
  Top 0.406: J2.P$13 29.06,39.61 30.58,41.13 42.14,41.13 42.16,41.15 v42.15,41.16
  Bottom 0.406: R31.2 43.08,24.74 43.08,40.23 v42.15,41.16 J6.5
CV14  (via drill 0.35)
  Top 0.254: R32.2 47.98,13.97 47.33,13.31 44.96,13.31 43.69,12.04 43.69,11.61 R16.P$1 42.04,9.96 42.04,9.14 42.32,8.86 43.94,8.86 46.33,6.47 MOS8.P$1 46.23,6.3
  Top 0.406: J2.P$12 31.06,39.61 32.02,40.57 34.81,40.57 35.5,39.88 40.89,39.88 v40.96,39.81
  Bottom 0.406: R32.2 42.52,20.73 42.52,38.25 v40.96,39.81 J6.4
CV15  (via drill 0.35)
  Top 0.254: 47.5,6.35 MOS8.P$3 | 47.5,6.35 47.5,6.82 47.33,6.99 46.39,6.99 45.82,7.55 45.82,8.8 45.98,8.97 48.84,8.97 R33.2 | R17.P$1 36.9,7.18 37.77,8.05 43.6,8.05 45.41,6.24 45.41,5.41 45.82,5 46.93,5 47.5,5.57 47.5,6.35
  Top 0.406: J2.P$11 33.06,39.61 34.02,38.65 39.58,38.65 v39.77,38.46
  Bottom 0.406: R33.2 41.96,16.71 41.96,36.27 v39.77,38.46 J6.3
EN
  Top 0.254: IC1.P$79 19.1,12.01 17.62,10.53 17.62,10.17 17.46,10.01 14.03,10.01 12.95,8.93 12.95,7.11 12.37,7.11 11.55,6.29 11.55,5.79 R1.P$2 8.57,2.81 8.21,2.81 7.18,1.78 J3.9
GND  (via drill 0.36)
  other vias: 15.75,34.29 21.72,19.05 3.3,11.68 3.3,7.11 3.56,2.29 8.26,3.81 11.18,7.75 24.38,12.32 38.99,6.35 41.15,9.4 45.21,11.43 30.73,20.07 8.89,20.07 3.3,20.83 3.3,16.26 8,22.1 8.89,28.96 3.3,29.97 3.56,39.37 7.62,31.24 15.62,24.64 28.32,34.92 38.86,34.54 37.34,27.43 43.43,23.11 44.2,25.91 45.21,29.46 47.24,31.5 51.56,29.97 51.82,25.65 51.56,20.83 51.82,16.26 52.07,34.54 45.47,37.59 51.56,39.37 51.31,11.68 51.82,7.11 15.75,10.92 42.8,9.65 21.26,13.21 30.73,3.56 42.04,4.32 20.32,4.7 20.45,8.76 15.49,3.94 25.53,4.06 8.26,38.61 15.11,28.7 31.88,11.3 25.15,16.76 27.43,15.75 25.4,10.67
  pour Top: 0.13,46.1 0,0 55.37,0 55.5,46.1
  pour Bottom: 0.13,46.1 0,0 55.37,0 55.5,46.1
LDOIN  (via drill 0.35)
  Top 0.254: IC1.P$13 28.27,9.35 28.27,10.2 29.34,11.27 R35.P$2
  Bottom 0.254: R35.P$2 28.35,12.63 28.35,12.99 27.43,13.9 R36.P$1
  other vias: 29.34,11.64
N$2
  Top 0.254: R19.1 3.5,6.04 MOS1.P$8 MOS1.P$7
N$8
  Bottom 0.254: C20.P$2 C21.P$2 | C21.P$2 22.77,12.02 23.98,13.23 24.41,13.23 24.64,13.46 24.64,14.14 IC2.P$1 | C21.P$2 22.73,11.48 V1.2
N$9
  Top 0.254: 13.11,16.51 R4.P$2 13.37,16.26 14.03,15.6 15.64,15.6 16.04,15.19 17.66,15.19 18.48,16.01 IC1.P$71
N$11
  Top 0.254: R5.P$2 13.88,18.54 14.03,18.39 15.64,18.39 16.04,17.98 19.2,17.98 19.22,18.01 IC1.P$67
N$12
  Top 0.254: IC1.P$75 18.95,14.01 18.03,13.08 18.03,12.8 17.63,12.39 14.43,12.39 12.86,13.97 R3.P$2
N$26
  Top 0.254: R6.P$2 13.67,20.83 14.03,21.18 15.64,21.18 16.04,20.78 18.3,20.78 18.98,20.1 19.83,20.1 IC1.P$63
N$29
  Top 0.254: IC1.P$59 22.67,24.22 22.49,24.22 22.42,24.29 21.54,24.29 20.83,25 | 20.83,25 | 20.83,25 20.27,25.55 20.27,28.82 21.72,30.27 R7.P$2
N$30
  Top 0.254: IC1.P$55 24.67,24.4 24.08,25 24.08,25.15 23.46,25.15 23.06,25.55 23.06,27.14 23.47,27.54 23.47,29.48 R8.P$2
N$31
  Top 0.254: R9.P$2 26.92,29.81 25.86,28.75 25.86,25.55 26.67,24.74 IC1.P$51
N$32
  Top 0.254: IC1.P$47 28.58,23.35 28.58,24.12 28.5,24.21 28.5,29.43 R10.P$2
N$33
  Top 0.254: IC1.P$43 30.67,24.93 31.29,25.55 31.29,29.69 R11.P$2
N$34
  Top 0.254: R12.P$2 40.99,21.34 39.41,22.91 36.22,22.91 35.82,22.51 35.82,22.23 34.95,21.36 34.95,20.76 34.7,20.51 IC1.P$39
N$35
  Top 0.254: R13.P$2 40.15,19.71 38.21,19.71 37.8,20.12 36.22,20.12 35.82,19.71 35.82,19.25 35.07,18.51 IC1.P$35
N$36
  Top 0.254: IC1.P$31 35.37,16.51 36.19,17.32 37.8,17.32 38.21,16.92 40.41,16.92 R14.P$2
N$37
  Top 0.254: R15.P$2 40.23,13.72 39.41,14.53 33.95,14.53 IC1.P$27
N$38
  Top 0.254: R16.P$2 39.97,11.18 39.26,11.89 36.22,11.89 35.6,12.51 IC1.P$23
N$39
  Top 0.254: IC1.P$19 31.17,8.45 32.64,6.99 34.59,6.99 R17.P$2
N$40
  Top 0.254: IC1.P$15 29.17,6.61 R18.P$2
N$41
  Top 0.254: MOS1.P$5 MOS1.P$6 8.48,6.2 8.48,6.67 8.32,6.83 4.85,6.83 R20.1
N$42
  Top 0.254: MOS2.P$7 MOS2.P$8 3.5,15.19 R21.1
N$43
  Top 0.254: MOS2.P$6 MOS2.P$5 9.11,15.19 8.32,15.98 4.85,15.98 R22.1
N$44
  Top 0.254: MOS3.P$7 MOS3.P$8 3.5,24.33 R23.1
N$45
  Top 0.254: MOS3.P$5 MOS3.P$6 8.23,24.49 8.23,24.96 8.07,25.12 4.85,25.12 R24.1
N$46
  Top 0.254: MOS4.P$7 MOS4.P$8 3.5,33.48 R25.1
N$47
  Top 0.254: MOS4.P$5 MOS4.P$6 8.23,33.63 8.23,34.1 8.07,34.27 4.85,34.27 R26.1
N$48
  Top 0.254: MOS5.P$7 MOS5.P$8 51.87,35.61 R27.1
N$49
  Top 0.254: MOS5.P$5 MOS5.P$6 47.14,35.46 47.14,34.99 47.31,34.82 50.52,34.82 R28.1
N$50
  Top 0.254: MOS6.P$7 MOS6.P$8 51.87,26.47 R29.1
N$51
  Top 0.254: MOS6.P$5 MOS6.P$6 47.14,26.31 47.14,25.84 47.31,25.68 50.52,25.68 R30.1
N$52
  Top 0.254: MOS7.P$7 MOS7.P$8 51.87,17.32 R31.1
N$53
  Top 0.254: MOS7.P$5 MOS7.P$6 47.14,17.17 47.14,16.7 47.31,16.54 50.52,16.54 R32.1
N$54
  Top 0.254: MOS8.P$7 MOS8.P$8 51.87,8.18 R33.1
N$55
  Top 0.254: MOS8.P$5 MOS8.P$6 47.14,8.03 47.14,7.55 47.31,7.39 50.52,7.39 R34.1
SAMPL
  Top 0.254: IC1.P$4 23.67,7.22 21.77,5.32 21.77,2.21 J3.3
SCLK  (via drill 0.35)
  Top 0.254: J3.6 14.74,2.81 16.4,2.81 22.17,8.59 IC1.P$1 22.17,11.72 22.38,11.93 22.38,16.32 22.84,16.79 23.64,16.79 v24.13,17.27
  Bottom 0.254: IC2.P$8 23.62,17.78 v24.13,17.27
SDI
  Top 0.254: J3.5 19.59,5.11 19.59,5.32 19.85,5.59 20.96,5.59 20.96,5.66 22.67,7.37 IC1.P$2
SDO  (via drill 0.35)
  Top 0.254: J3.4 20.68,3.66 21,3.66 21.37,4.02 21.37,5.49 23.16,7.29 IC1.P$3 23.17,16.07 v23.11,16.13
  Bottom 0.254: IC2.P$7 23.12,16.64 v23.11,16.13
T1
  Top 0.254: 26.14,9.22 IC1.P$9 26.17,5.86 27.32,4.72 29.7,4.72 29.72,4.7 32.74,4.7 33.94,3.5 45.01,3.5 J1.2
T2
  Top 0.254: IC1.P$8 25.74,9.19 25.74,5.72 27.17,4.29 32.57,4.29 33.77,3.1 37.8,3.1 J1.5
T3
  Top 0.254: J1.8 29.39,3.89 27,3.89 25.17,5.71 IC1.P$7
VP  (via drill 0.35)
  Top 0.254: v26.92,7.62 26.8,7.62 26.87,7.69 R18.P$1 28.67,8.3 IC1.P$14 28.77,9.35 28.77,10.12 28.93,10.29 31.92,10.29 32.93,9.27 v33.66,9.27
  Bottom 0.254: 44.32,5.21 38.1,5.21 34.04,9.27 v33.66,9.27 33.47,9.45 R35.P$1 | 44.32,5.21 45.85,3.68 48.13,3.68 R34.2 | J2.P$9 34.78,37.61 | v26.92,7.62 26.92,7.57 C19.P$2 | 44.32,5.21 43.31,6.22 C22.P$2
  Bottom 0.406: R34.2 41.4,12.7 41.4,34.29 36.43,39.26 | 35.15,40.54 36.43,39.26 | 35.15,40.54 J6.2 | 34.78,37.61 36.43,39.26 | J2.P$10 34.42,39.81 35.15,40.54
  other vias: 42.75,6.22